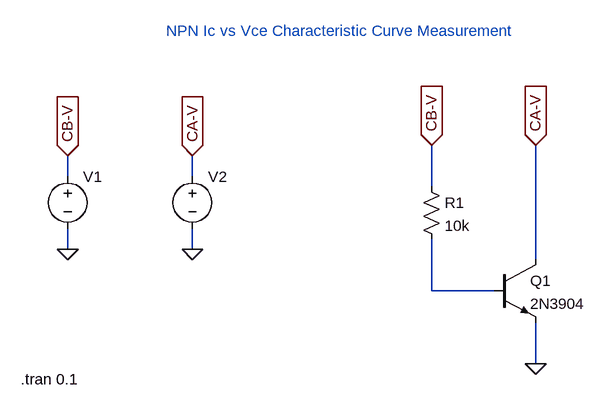
[diagram p0: schematic npn_char_curve_ltspice.asc]
npn_char_curve_ltspice.asc, the LTspice schematic file:
Version 4
SHEET 1 2712 680
WIRE -416 -80 -416 -112
WIRE -224 -80 -224 -112
WIRE 144 -64 144 -128
WIRE -416 32 -416 0
WIRE -224 32 -224 0
WIRE 304 48 304 -128
WIRE 144 96 144 16
WIRE 240 96 144 96
WIRE 304 208 304 144
FLAG 304 208 0
FLAG 144 -128 CB-V
IOPIN 144 -128 In
FLAG 304 -128 CA-V
IOPIN 304 -128 In
FLAG -416 32 0
FLAG -224 32 0
FLAG -416 -112 CB-V
IOPIN -416 -112 In
FLAG -224 -112 CA-V
IOPIN -224 -112 In
SYMBOL npn 240 48 R0
SYMATTR InstName Q1
SYMATTR Value 2N3904
SYMBOL res 128 -80 R0
SYMATTR InstName R1
SYMATTR Value 10k
SYMBOL voltage -416 -96 R0
WINDOW 3 24 96 Invisible 2
SYMATTR InstName V1
SYMATTR Value PWL REPEAT FOREVER (0 0.6 5m 0.6 5.0001m 1.2 10m 1.2 10.0001m 1.8 15m 1.8 15.0001m 2.2 20m 2.2 20.0001m 2.6 25m 2.6 25.0001m 3 30m 3 30.0001m 3.4 35m 3.4 35.0001m 3.8 40m 3.8 40.0001m 4.2 45m 4.2 45.0001m 4.6 50m 4.6 50.0001m 0.6) ENDREPEAT
SYMBOL voltage -224 -96 R0
WINDOW 3 24 96 Invisible 2
SYMATTR InstName V2
SYMATTR Value PWL REPEAT FOREVER(0 2.5 1.25m 5 2.5m 2.5 3.75m 0 5m 2.5) ENDREPEAT
TEXT -488 232 Left 2 !.tran 0.1
TEXT -264 -304 Left 2 ;NPN Ic vs Vce Characteristic Curve Measurement

The netlist it stands for:
* npn_char_curve_ltspice.asc
Q1 CA-V N001 0 0 2N3904
R1 CB-V N001 10k
V1 CB-V 0 PWL REPEAT FOREVER (0 0.6 5m 0.6 5.0001m 1.2 10m 1.2 10.0001m 1.8 15m 1.8 15.0001m 2.2 20m 2.2 20.0001m 2.6 25m 2.6 25.0001m 3 30m 3 30.0001m 3.4 35m 3.4 35.0001m 3.8 40m 3.8 40.0001m 4.2 45m 4.2 45.0001m 4.6 50m 4.6 50.0001m 0.6) ENDREPEAT
V2 CA-V 0 PWL REPEAT FOREVER(0 2.5 1.25m 5 2.5m 2.5 3.75m 0 5m 2.5) ENDREPEAT
.model NPN NPN
.model PNP PNP
.lib standard.bjt
.tran 0.1
* NPN Ic vs Vce Characteristic Curve Measurement
.backanno
.end